# Altium schematic sheet stm side.SchDoc
size A4
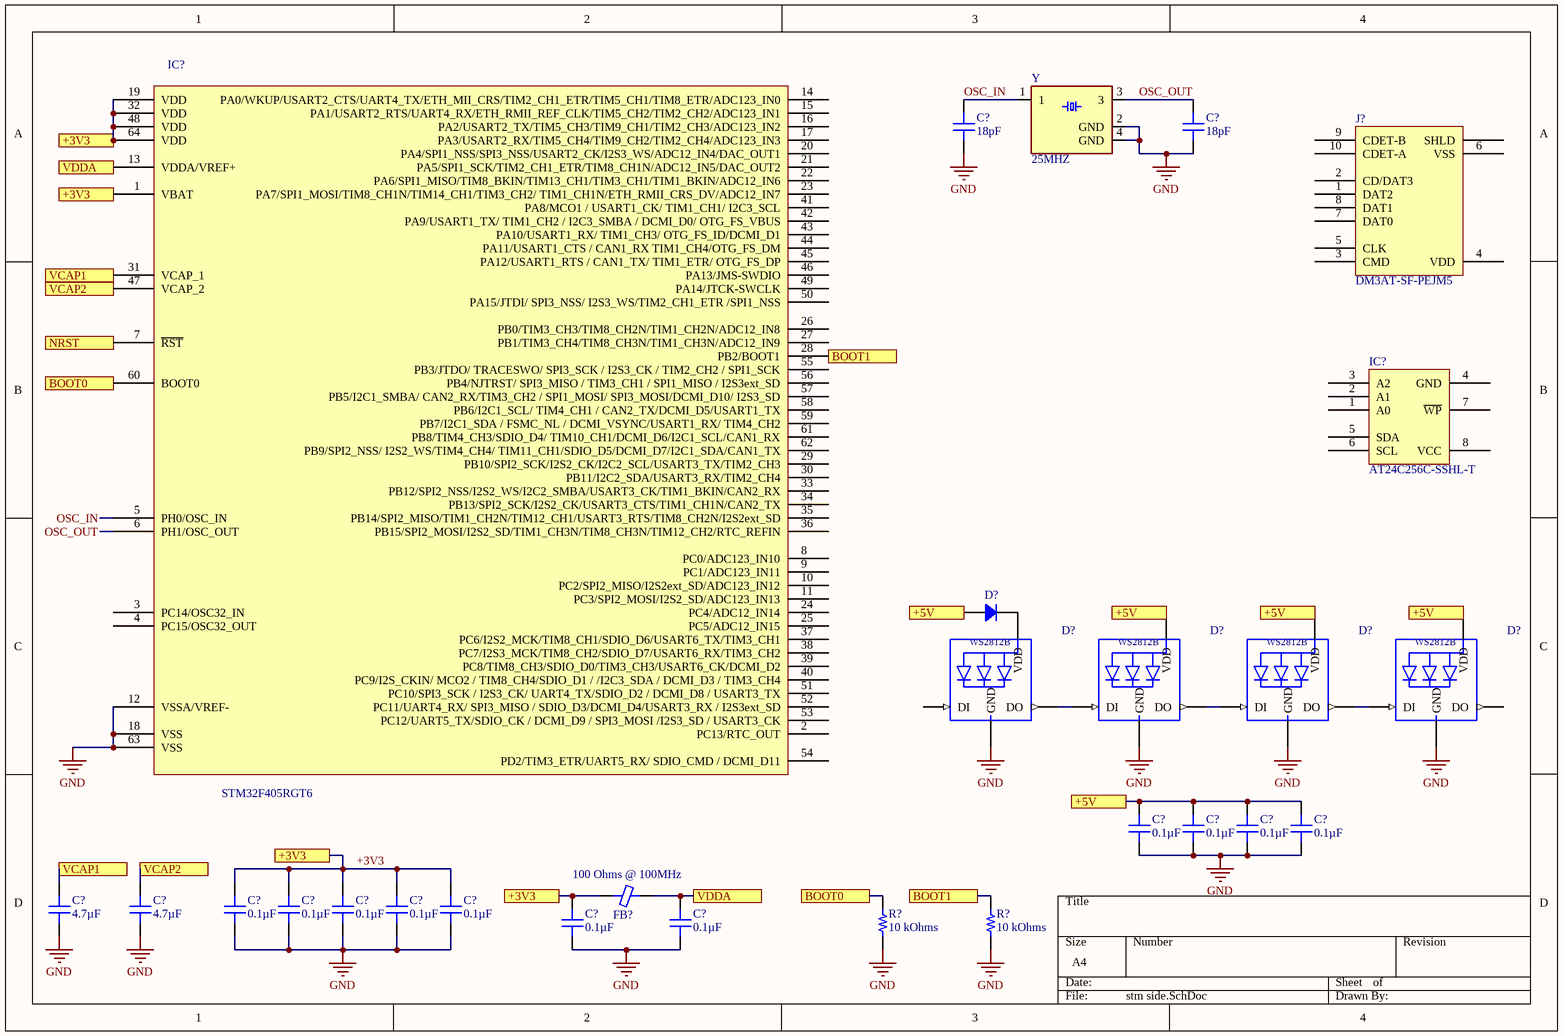
[diagram p0: stm side.SchDoc]

## Parts
(Parts that share a designator on the sheet are numbered #1, #2 ... from top to bottom, then left to right.)
C?#1  18pF  [CAP 0603_1608]
C?#2  18pF  [CAP 0603_1608]
C?#3  0.1µF  [CAP 0805_2012]
C?#4  0.1µF  [CAP 0805_2012]
C?#5  0.1µF  [CAP 0805_2012]
C?#6  0.1µF  [CAP 0805_2012]
C?#7  4.7µF  [CAP 0805_2012]
C?#8  4.7µF  [CAP 0805_2012]
C?#9  0.1µF  [CAP 0805_2012]
C?#10  0.1µF  [CAP 0805_2012]
C?#11  0.1µF  [CAP 0805_2012]
C?#12  0.1µF  [CAP 0805_2012]
C?#13  0.1µF  [CAP 0805_2012]
C?#14  0.1µF  [CAP 0805_2012]
C?#15  0.1µF  [CAP 0805_2012]
D?#1  SMLJ60S05-TP  [DO214AB SMC]  (value not drawn)
D?#2  WS2812B  [WS2812B]  (value not drawn)
D?#3  WS2812B  [WS2812B]  (value not drawn)
D?#4  WS2812B  [WS2812B]  (value not drawn)
D?#5  WS2812B  [WS2812B]  (value not drawn)
FB?  100 Ohms @ 100MHz  [FER 0805_2012]
IC?#1  AT24C256C-SSHL-T  [MICROCHIP SOIC-8 150MIL WIDE]
IC?#2  STM32F405RGT6  [ST LQFP-64 10X10MM]
J?  DM3AT-SF-PEJM5  [HIROSE DM3AT-SF-PEJM5]
R?#1  10 kOhms  [RES 0805_2012]
R?#2  10 kOhms  [RES 0805_2012]
Y  25MHZ  [OSCSC320X250X100N]

## Ports
+3V3, +5V, BOOT0, BOOT1, NRST, VCAP1, VCAP2, VDDA

## Nets
GND: C?#1.1 C?#2.1 C?#3.2 C?#4.2 C?#5.2 C?#6.2 C?#7.2 C?#8.2 C?#9.2 C?#10.2 C?#11.2 C?#12.2 C?#13.2 C?#14.2 C?#15.2 D?#2.3-GND(GND) D?#3.3-GND(GND) D?#4.3-GND(GND) D?#5.3-GND(GND) IC?#2.12(VSSA/VREF-) IC?#2.18(VSS) IC?#2.63(VSS) R?#1.2 R?#2.2 Y.2(GND) Y.4(GND)
+3V3: C?#9.1 C?#10.1 C?#11.1 C?#12.1 C?#13.1 C?#14.1 FB?.1 IC?#2.1(VBAT) IC?#2.19(VDD) IC?#2.32(VDD) IC?#2.48(VDD) IC?#2.64(VDD) ; port +3V3
+5V: C?#3.1 C?#4.1 C?#5.1 C?#6.1 D?#1.1 D?#3.1-VDD(VDD) D?#4.1-VDD(VDD) D?#5.1-VDD(VDD) ; port +5V
BOOT0: IC?#2.60(BOOT0) R?#1.1 ; port BOOT0
BOOT1: IC?#2.28(PB2/BOOT1) R?#2.1 ; port BOOT1
NRST: IC?#2.7(~{RST}) ; port NRST
OSC_IN: C?#1.2 IC?#2.5(PH0/OSC_IN) Y.1
OSC_OUT: C?#2.2 IC?#2.6(PH1/OSC_OUT) Y.3
VCAP1: C?#7.1 IC?#2.31(VCAP_1) ; port VCAP1
VCAP2: C?#8.1 IC?#2.47(VCAP_2) ; port VCAP2
VDDA: C?#15.1 FB?.2 IC?#2.13(VDDA/VREF+) ; port VDDA
NetD?#1_2: D?#1.2 D?#2.1-VDD(VDD)
NetD?#2_2-DOUT: D?#2.2-DOUT(DO) D?#3.4-DIN(DI)
NetD?#3_2-DOUT: D?#3.2-DOUT(DO) D?#4.4-DIN(DI)
NetD?#4_2-DOUT: D?#4.2-DOUT(DO) D?#5.4-DIN(DI)

Not connected (* = marked no-connect by the designer): D?#2 4-DIN(DI); D?#5 2-DOUT(DO); IC?#1 1(A0) 2(A1) 3(A2) 4(GND) 5(SDA) 6(SCL) 7(~{WP}) 8(VCC); IC?#2 2(PC13/RTC_OUT) 3(PC14/OSC32_IN) 4(PC15/OSC32_OUT) 8(PC0/ADC123_IN10) 9(PC1/ADC123_IN11) 10(PC2/SPI2_MISO/I2S2ext_SD/ADC123_IN12) 11(PC3/SPI2_MOSI/I2S2_SD/ADC123_IN13) 14(PA0/WKUP/USART2_CTS/UART4_TX/ETH_MII_CRS/TIM2_CH1_ETR/TIM5_CH1/TIM8_ETR/ADC123_IN0) 15(PA1/USART2_RTS/UART4_RX/ETH_RMII_REF_CLK/TIM5_CH2/TIM2_CH2/ADC123_IN1) 16(PA2/USART2_TX/TIM5_CH3/TIM9_CH1/TIM2_CH3/ADC123_IN2) 17(PA3/USART2_RX/TIM5_CH4/TIM9_CH2/TIM2_CH4/ADC123_IN3) 20(PA4/SPI1_NSS/SPI3_NSS/USART2_CK/I2S3_WS/ADC12_IN4/DAC_OUT1) 21(PA5/SPI1_SCK/TIM2_CH1_ETR/TIM8_CH1N/ADC12_IN5/DAC_OUT2) 22(PA6/SPI1_MISO/TIM8_BKIN/TIM13_CH1/TIM3_CH1/TIM1_BKIN/ADC12_IN6) 23(PA7/SPI1_MOSI/TIM8_CH1N/TIM14_CH1/TIM3_CH2/_TIM1_CH1N/ETH_RMII_CRS_DV/ADC12_IN7) 24(PC4/ADC12_IN14) 25(PC5/ADC12_IN15) 26(PB0/TIM3_CH3/TIM8_CH2N/TIM1_CH2N/ADC12_IN8) 27(PB1/TIM3_CH4/TIM8_CH3N/TIM1_CH3N/ADC12_IN9) 29(PB10/SPI2_SCK/I2S2_CK/I2C2_SCL/USART3_TX/TIM2_CH3) 30(PB11/I2C2_SDA/USART3_RX/TIM2_CH4) 33(PB12/SPI2_NSS/I2S2_WS/I2C2_SMBA/USART3_CK/TIM1_BKIN/CAN2_RX) 34(PB13/SPI2_SCK/I2S2_CK/USART3_CTS/TIM1_CH1N/CAN2_TX) 35(PB14/SPI2_MISO/TIM1_CH2N/TIM12_CH1/USART3_RTS/TIM8_CH2N/I2S2ext_SD) 36(PB15/SPI2_MOSI/I2S2_SD/TIM1_CH3N/TIM8_CH3N/TIM12_CH2/RTC_REFIN) 37(PC6/I2S2_MCK/TIM8_CH1/SDIO_D6/USART6_TX/TIM3_CH1) 38(PC7/I2S3_MCK/TIM8_CH2/SDIO_D7/USART6_RX/TIM3_CH2) 39(PC8/TIM8_CH3/SDIO_D0/TIM3_CH3/USART6_CK/DCMI_D2) 40(PC9/I2S_CKIN/_MCO2_/_TIM8_CH4/SDIO_D1_/_/I2C3_SDA_/_DCMI_D3_/_TIM3_CH4) 41(PA8/MCO1_/_USART1_CK/_TIM1_CH1/_I2C3_SCL) 42(PA9/USART1_TX/_TIM1_CH2_/_I2C3_SMBA_/_DCMI_D0/_OTG_FS_VBUS) 43(PA10/USART1_RX/_TIM1_CH3/_OTG_FS_ID/DCMI_D1) 44(PA11/USART1_CTS_/_CAN1_RX_TIM1_CH4/OTG_FS_DM) 45(PA12/USART1_RTS_/_CAN1_TX/_TIM1_ETR/_OTG_FS_DP) 46(PA13/JMS-SWDIO) 49(PA14/JTCK-SWCLK) 50(PA15/JTDI/_SPI3_NSS/_I2S3_WS/TIM2_CH1_ETR_/SPI1_NSS) 51(PC10/SPI3_SCK_/_I2S3_CK/_UART4_TX/SDIO_D2_/_DCMI_D8_/_USART3_TX) 52(PC11/UART4_RX/_SPI3_MISO_/_SDIO_D3/DCMI_D4/USART3_RX_/_I2S3ext_SD) 53(PC12/UART5_TX/SDIO_CK_/_DCMI_D9_/_SPI3_MOSI_/I2S3_SD_/_USART3_CK) 54(PD2/TIM3_ETR/UART5_RX/_SDIO_CMD_/_DCMI_D11) 55(PB3/JTDO/_TRACESWO/_SPI3_SCK_/_I2S3_CK_/_TIM2_CH2_/_SPI1_SCK) 56(PB4/NJTRST/_SPI3_MISO_/_TIM3_CH1_/_SPI1_MISO_/_I2S3ext_SD) 57(PB5/I2C1_SMBA/_CAN2_RX/TIM3_CH2_/_SPI1_MOSI/_SPI3_MOSI/DCMI_D10/_I2S3_SD) 58(PB6/I2C1_SCL/_TIM4_CH1_/_CAN2_TX/DCMI_D5/USART1_TX) 59(PB7/I2C1_SDA_/_FSMC_NL_/_DCMI_VSYNC/USART1_RX/_TIM4_CH2) 61(PB8/TIM4_CH3/SDIO_D4/_TIM10_CH1/DCMI_D6/I2C1_SCL/CAN1_RX) 62(PB9/SPI2_NSS/_I2S2_WS/TIM4_CH4/_TIM11_CH1/SDIO_D5/DCMI_D7/I2C1_SDA/CAN1_TX); J? 1(DAT2) 2(CD/DAT3) 3(CMD) 4(VDD) 5(CLK) 6(VSS) 7(DAT0) 8(DAT1) 9(CDET-B) 10(CDET-A) S(SHLD)

## Library data of the parts
C?#1 C?#2 = VJ0603A180FXJCW1BC: CAP CER 18PF 16V C0G/NP0 0603; Manufacturer: Vishay Vitramon; Temperature Coefficient: C0G, NP0; Tolerance: ±1%; Part Number: VJ0603A180FXJCW1BC; Value: 18pF; Applications: General Purpose; Capacitance: 18pF; ComponentLink1Description: Datasheet; ComponentLink1URL: https://www.vishay.com/docs/28548/vjw1bcbascomseries.pdf; ComponentLink2Description: DigiKey Link; ComponentLink2URL: http://digikey.com/product-detail/en/vishay-vitramon/VJ0603A180FXJCW1BC/720-1659-1-ND/8324079; Device Package: 0603 (1608 Metric); LastUpdated: 2.9.2020 01:03:27; Lifecycle Status: Active; Minimum Order: 1; Mounting Type: Surface Mount, MLCC; Operating Temperature: -55°C ~ 125°C; Package / Case: 0603 (1608 Metric); Packaging: TapeAndReel; PartId: 7092; Part Status: Active; Price: 0.04; Series: VJ; Size / Dimension: 0.063" L x 0.031" W (1.60mm x 0.80mm); Supplier 1: DigiKey; Supplier Part Number 1: 720-1659-1-ND; Thickness (Max): 0.034" (0.87mm); Voltage - Rated: 16V
C?#3-C?#6 C?#9-C?#15 = 08053D475MAT2A: CAP CER 4.7UF 25V X5R 0805; Manufacturer: AVX Corporation; Capacitance: 4.7µF; Tolerance: ±20%; Part Number: 08053D475MAT2A; Value: 0.1µF; Applications: General Purpose; ComponentLink1Description: Datasheet; ComponentLink1URL: http://datasheets.avx.com/cx5r.pdf; ComponentLink2Description: DigiKey Link; ComponentLink2URL: http://digikey.com/product-detail/en/avx-corporation/08053D475MAT2A/478-5321-1-ND/1950988; Device Package: 0805 (2012 Metric); LastUpdated: 2.9.2020 01:04:37; Lifecycle Status: Active; Minimum Order: 1; Mounting Type: Surface Mount, MLCC; Operating Temperature: -55°C ~ 85°C; Package / Case: 0805 (2012 Metric); Packaging: TapeAndReel; PartId: 5116; Part Status: Active; Price: 0.14; Series: -; Size / Dimension: 0.079" L x 0.049" W (2.01mm x 1.25mm); Supplier 1: DigiKey; Supplier Part Number 1: 478-5321-1-ND; Temperature Coefficient: X5R; Thickness (Max): 0.055" (1.40mm); Voltage - Rated: 25V
C?#7 C?#8 = 08053D475MAT2A: CAP CER 4.7UF 25V X5R 0805; Manufacturer: AVX Corporation; Tolerance: ±20%; Part Number: 08053D475MAT2A; Value: 4.7µF; Applications: General Purpose; Capacitance: 4.7µF; ComponentLink1Description: Datasheet; ComponentLink1URL: http://datasheets.avx.com/cx5r.pdf; ComponentLink2Description: DigiKey Link; ComponentLink2URL: http://digikey.com/product-detail/en/avx-corporation/08053D475MAT2A/478-5321-1-ND/1950988; Device Package: 0805 (2012 Metric); LastUpdated: 2.9.2020 01:04:37; Lifecycle Status: Active; Minimum Order: 1; Mounting Type: Surface Mount, MLCC; Operating Temperature: -55°C ~ 85°C; Package / Case: 0805 (2012 Metric); Packaging: TapeAndReel; PartId: 5116; Part Status: Active; Price: 0.14; Series: -; Size / Dimension: 0.079" L x 0.049" W (2.01mm x 1.25mm); Supplier 1: DigiKey; Supplier Part Number 1: 478-5321-1-ND; Temperature Coefficient: X5R; Thickness (Max): 0.055" (1.40mm); Voltage - Rated: 25V
D?#1 = SMLJ60S05-TP: DIODE GEN PURP 50V 6A DO214AB; Manufacturer: Micro Commercial Co; Capacitance @ Vr, F: 150pF @ 4V, 1MHz; Current - Reverse Leakage @ Vr: 5µA @ 50V; Diode Type: Standard; Speed: Standard Recovery >500ns, > 200mA (Io); Voltage - Forward (Vf) (Max) @ If: 1V @ 6A; Part Number: SMLJ60S05-TP; ComponentLink1Description: Datasheet; ComponentLink1URL: https://www.mccsemi.com/pdf/Products/SMLJ60S05~SMLJ60S10(DO-214AB).pdf; ComponentLink2Description: DigiKey Link; ComponentLink2URL: http://digikey.com/product-detail/en/micro-commercial-co/SMLJ60S05-TP/SMLJ60S05-TPMSCT-ND/2404599; Current - Average Rectified (Io): 6A; LastUpdated: 2.9.2020 01:18:57; Lifecycle Status: Active; Minimum Order: 1; Mounting Type: Surface Mount; Operating Temperature - Junction: -55°C ~ 150°C; Package / Case: DO-214AB, SMC; Packaging: TapeAndReel; PartId: 345; Part Status: Active; Price: 0.40; Series: -; Supplier 1: DigiKey; Supplier Part Number 1: SMLJ60S05-TPMSCT-ND; Supplier Device Package: DO-214AB (SMC); Voltage - DC Reverse (Vr) (Max): 50V
D?#2-D?#5 = WS2812B: Raspberry Pi HAT _40 pin_ Wheeled Robotics Kit; MF: SparkFun Electronics; Availability: Unavailable; SnapEDA_Link: https://www.snapeda.com/parts/WS2812B/Worldsemi/view-part/1038297/?ref=snap; MP: WS2812B; Price: None; Value: *; Package: None
FB? = MH2029-101Y: FERRITE BEAD 100 OHM 0805 1LN; Manufacturer: Bourns Inc.; Current Rating (Max): 2A; DC Resistance (DCR) (Max): 100mOhm; Filter Type: Power, Signal Line; Number of Lines: 1; Part Number: MH2029-101Y; ComponentLink1Description: Datasheet; ComponentLink1URL: https://www.bourns.com/docs/Product-Datasheets/mh.pdf; ComponentLink2Description: DigiKey Link; ComponentLink2URL: http://digikey.com/product-detail/en/bourns-inc/MH2029-101Y/MH2029-101YCT-ND/6100092; Device Package: 0805 (2012 Metric); Height (Max): 0.043" (1.10mm); Impedance @ Frequency: 100 Ohms @ 100MHz; LastUpdated: 2.9.2020 01:18:23; Lifecycle Status: Active; Minimum Order: 1; Mounting Type: Surface Mount; Operating Temperature: -55°C ~ 125°C; Package / Case: 0805 (2012 Metric); Packaging: TapeAndReel; PartId: 1212; Part Status: Active; Price: 0.02; Series: MH; Size / Dimension: 0.079" L x 0.047" W (2.00mm x 1.20mm); Supplier 1: DigiKey; Supplier Part Number 1: MH2029-101YCT-ND; Value: 100 Ohms @ 100MHz
IC?#1 = AT24C256C-SSHL-T: IC EEPROM 256K I2C 1MHZ 8SOIC; Manufacturer: Microchip Technology; Access Time: 550ns; Memory Interface: I²C; Memory Size: 256Kb (32K x 8); Memory Type: Non-Volatile; Voltage - Supply: 1.7V ~ 5.5V; Write Cycle Time - Word, Page: 5ms; Part Number: AT24C256C-SSHL-T; Clock Frequency: 1MHz; ComponentLink1Description: Datasheet; ComponentLink1URL: http://www.microchip.com/mymicrochip/filehandler.aspx?ddocname=en590396; ComponentLink2Description: DigiKey Link; ComponentLink2URL: http://digikey.com/product-detail/en/microchip-technology/AT24C256C-SSHL-T/AT24C256C-SSHL-TCT-ND/3178468; LastUpdated: 2.9.2020 01:23:03; Lifecycle Status: Active; Memory Format: EEPROM; Minimum Order: 1; Mounting Type: Surface Mount; Operating Temperature: -40°C ~ 85°C (TA); Package / Case: 8-SOIC (0.154", 3.90mm Width); Packaging: TapeAndReel; PartId: 1099; Part Status: Active; Price: 0.56; Series: -; Supplier 1: DigiKey; Supplier Part Number 1: AT24C256C-SSHL-TCT-ND; Supplier Device Package: 8-SOIC; Technology: EEPROM
IC?#2 = STM32F405RGT6: IC MCU 32BIT 1MB FLASH 64LQFP; Manufacturer: STMicroelectronics; Connectivity: CANbus, I²C, IrDA, LINbus, SPI, UART/USART, USB OTG; Core Processor: ARM® Cortex®-M4; Core Size: 32-Bit; Data Converters: A/D 16x12b; D/A 2x12b; Number of I/O: 51; Oscillator Type: Internal; Peripherals: Brown-out Detect/Reset, DMA, I²S, LCD, POR, PWM, WDT; Program Memory Size: 1MB (1M x 8); RAM Size: 192K x 8; Speed: 168MHz; Voltage - Supply (Vcc/Vdd): 1.8V ~ 3.6V; Part Number: STM32F405RGT6; ComponentLink1Description: Datasheet; ComponentLink1URL: http://www.st.com/content/ccc/resource/technical/document/datasheet/ef/92/76/6d/bb/c2/4f/f7/DM00037051.pdf/files/DM00037051.pdf/jcr:content/translations/en.DM00037051.pdf; ComponentLink2Description: DigiKey Link; ComponentLink2URL: //digikey.com/product-detail/en/stmicroelectronics/STM32F405RGT6/497-11767-ND/2754208; Device Package: 64-LQFP; LastUpdated: 5.12.2019 23:44:20; Lifecycle Status: 0; Minimum Order: 1; Mounting Type: Surface Mount; Operating Temperature: -40°C ~ 85°C (TA); Package / Case: 64-LQFP; Packaging: Tray; PartId: 115; Part Status: Active; Price: 10.30; Program Memory Type: FLASH; Series: STM32F4; Supplier 1: DigiKey; Supplier Part Number 1: 497-11767-ND; Supplier Device Package: 64-LQFP (10x10)
J? = DM3AT-SF-PEJM5: CONN MICRO SD CARD PUSH-PUSH R/A; Manufacturer: Hirose Electric Co Ltd; Card Type: Secure Digital - microSD™; Connector Type: Connector and Ejector; Insertion, Removal Method: Push In, Push Out; Number of Positions: 10 (8 + 2); Part Number: DM3AT-SF-PEJM5; ComponentLink1Description: Datasheet; ComponentLink1URL: https://www.hirose.com/product/document?clcode=CL0609-0033-6-00&productname=DM3AT-SF-PEJ2M5&series=DM3&documenttype=Catalog&lang=en&documentid=D49662_en; ComponentLink2Description: DigiKey Link; ComponentLink2URL: //digikey.com/product-detail/en/hirose-electric-co-ltd/DM3AT-SF-PEJM5/HR1964TR-ND/2533565; Contact Finish: Gold; Features: Switch; Height Above Board: 0.066" (1.68mm); LastUpdated: 16.12.2019 20:34:40; Lifecycle Status: 0; Minimum Order: 1; Mounting Feature: Normal, Standard - Top; Mounting Type: Surface Mount, Right Angle; Packaging: TapeAndReel; Part Status: Active; Price: 1.41; Series: DM3; Supplier 1: DigiKey; Supplier Part Number 1: HR1964TR-ND
R?#1 R?#2 = CRS0805-FX-1002ELF: RES SMD 10K OHM 1% 1/4W 0805; Manufacturer: Bourns Inc.; Power (Watts): 0.25W, 1/4W; Temperature Coefficient: ±100ppm/°C; Part Number: CRS0805-FX-1002ELF; Value: 10 kOhms; ComponentLink1Description: Datasheet; ComponentLink1URL: https://www.bourns.com/data/global/pdfs/CRS.pdf; ComponentLink2Description: DigiKey Link; ComponentLink2URL: http://digikey.com/product-detail/en/bourns-inc/CRS0805-FX-1002ELF/CRS0805-FX-1002ELFCT-ND/5778744; Composition: Thick Film; Device Package: 0805 (2012 Metric); Features: High Voltage, Pulse Withstanding; Height - Seated (Max): 0.024" (0.60mm); LastUpdated: 2.9.2020 01:14:26; Lifecycle Status: Active; Minimum Order: 1; Number of Terminations: 2; Operating Temperature: -55°C ~ 155°C; Package / Case: 0805 (2012 Metric); Packaging: TapeAndReel; PartId: 49386; Part Status: Active; Price: 0.04; Resistance: 10 kOhms; Series: CRS; Size / Dimension: 0.079" L x 0.049" W (2.00mm x 1.25mm); Supplier 1: DigiKey; Supplier Part Number 1: CRS0805-FX-1002ELFCT-ND; Supplier Device Package: 0805; Tolerance: ±1%
Y = ABM8AIG-16.000MHZ-12-2Z-T3: 16MHz Â±20ppm Crystal 12pF 70 Ohms 4-SMD, No Lead; MF: Abracon; Availability: Unavailable; Price: None; SnapEDA_Link: https://www.snapeda.com/parts/ABM8AIG-16.000MHZ-12-2Z-T3/Abracon%20LLC/view-part/454828/?ref=snap; Value: *; MP: ABM8AIG-16.000MHZ-12-2Z-T3; Package: SMD-4 Abracon